# Altium schematic sheet Sheet7.SchDoc
size A4
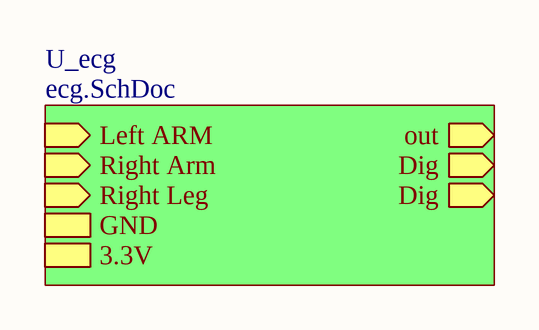
[diagram p0: Sheet7.SchDoc]

## Sub-sheets
U_ecg = ecg.SchDoc: Left ARM (in), Right Arm (in), Right Leg (in), out (out), Dig (out), Dig (out), GND, 3.3V